# EAGLE design SOIC16-TSSOP16 (EAGLE 7.2.0)
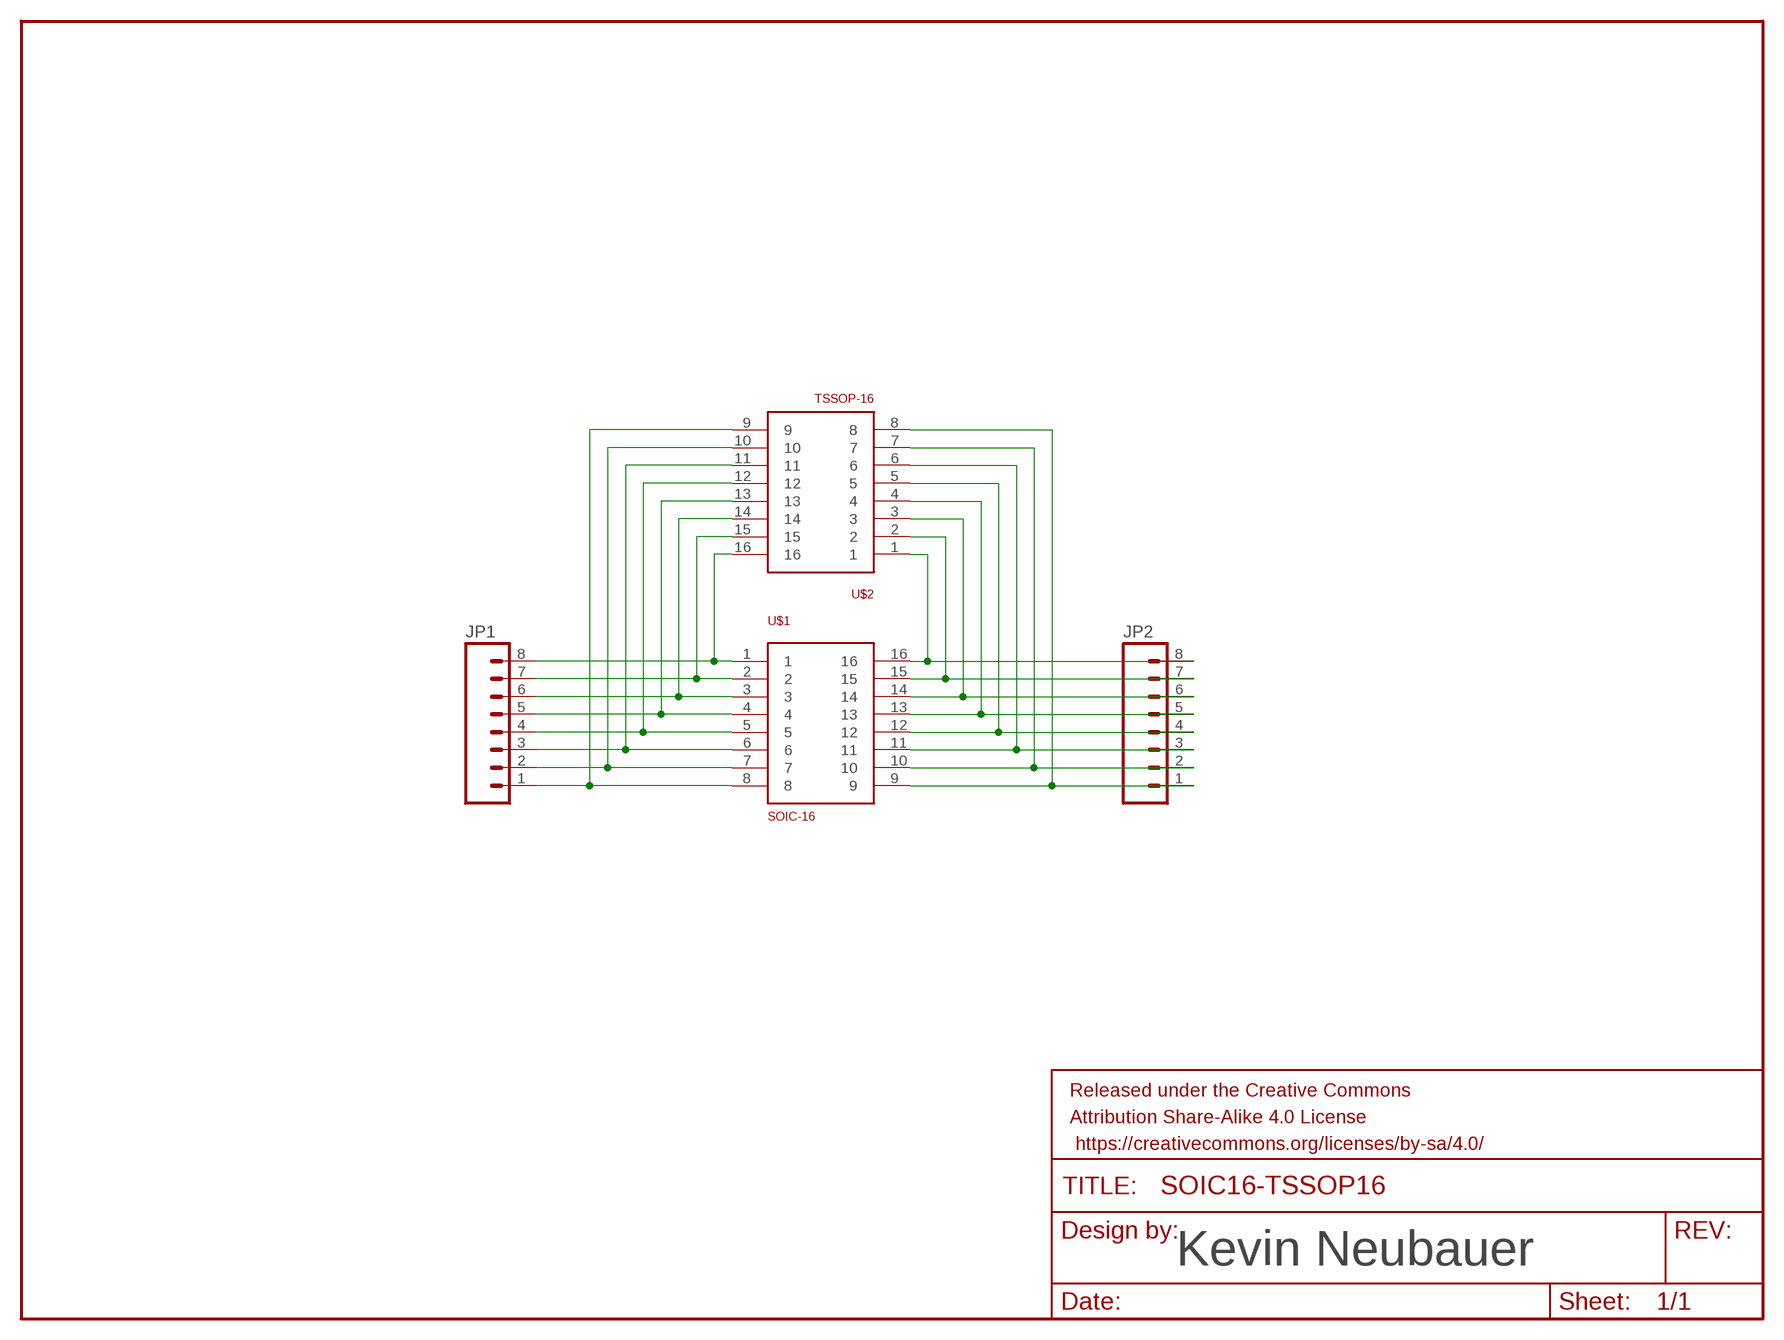
[diagram p0: schematic, sheet 1]

## Parts
FRAME1  FRAME-LETTER  [CREATIVE_COMMONS]
JP1  M08NO_SILK  [1X08_NO_SILK]
JP2  M08NO_SILK  [1X08_NO_SILK]
U$1  SOIC-16  [SO16]
U$2  TSSOP-16  [TSSOP16]

## Nets
N$1: JP1.8 U$1.1 U$2.16
N$2: JP1.7 U$1.2 U$2.15
N$3: JP1.6 U$1.3 U$2.14
N$4: JP1.5 U$1.4 U$2.13
N$5: JP1.4 U$1.5 U$2.12
N$6: JP1.3 U$1.6 U$2.11
N$7: JP1.2 U$1.7 U$2.10
N$8: JP1.1 U$1.8 U$2.9
N$11: JP2.8 U$1.16 U$2.1
N$12: JP2.7 U$1.15 U$2.2
N$13: JP2.6 U$1.14 U$2.3
N$14: JP2.5 U$1.13 U$2.4
N$15: JP2.4 U$1.12 U$2.5
N$16: JP2.3 U$1.11 U$2.6
N$17: JP2.2 U$1.10 U$2.7
N$18: JP2.1 U$1.9 U$2.8

## Notes on the sheet
- Kevin Neubauer

## Library data of the parts
FRAME1 = SparkFun-Aesthetics:FRAME-LETTER: Schematic Frame Standard 8.5x11 US Letter frame
JP1 JP2 = SparkFun-Connectors:M08: Header 8 Standard 8-pin 0.1" header. Use with straight break away headers (SKU : PRT-00116), right angle break away headers (PRT-00553), swiss pins (PRT-00743), machine pins (PRT-00117), and female headers (PRT-00115).
U$1 = Kevin-GenericICFootprints:SOIC-16
U$2 = Kevin-GenericICFootprints:TSSOP-16

## Board
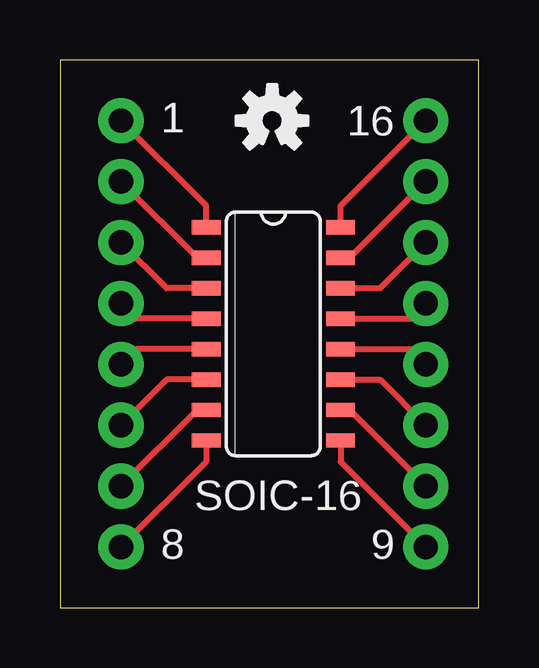
[diagram p1: board, top side]
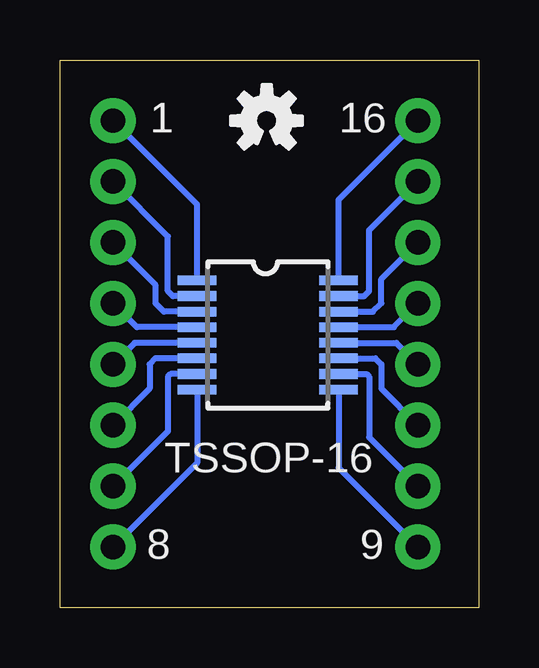
[diagram p2: board, bottom side, seen from below]

Size 17.45 x 22.85 mm. Coordinates in mm from the lower left corner, seen from the top.
Outline: 0,0 17.45,0 17.45,22.85 0,22.85 0,0
Copper layers (1*16): Top 0.035mm / dielectric 1.5mm / Bottom 0.035mm
Design rules "dirt_cheap_dirty_boards.v1": minimum track width 5mil, minimum drill 12mil, track to track 5mil, track to pad 5mil, pad to pad 5mil, via to via 5mil, smd to smd 0mil, copper to edge 10mil, drill to drill 10mil, minimum pad ring 10mil, minimum via ring 6mil, stop-mask expansion 2mil, vias tented up to drill 25mil, thermal gap 10mil

### Footprints (pad centres in the part's own frame; a part is rotated, then mirrored left to right if it is on the bottom)
1X08_NO_SILK = drill 1.016 pad 1.88: 1 0,0; 2 2.54,0; 3 5.08,0; 4 7.62,0; 5 10.16,0; 6 12.7,0; 7 15.24,0; 8 17.78,0
SO16 = smd 0.6 x 1.2: 1 -4.445,-2.8; 2 -3.175,-2.8; 3 -1.905,-2.8; 4 -0.635,-2.8; 5 0.635,-2.8; 6 1.905,-2.8; 7 3.175,-2.8; 8 4.445,-2.8; 9 4.445,2.8; 10 3.175,2.8; 11 1.905,2.8; 12 0.635,2.8; 13 -0.635,2.8; 14 -1.905,2.8; 15 -3.175,2.8; 16 -4.445,2.8
TSSOP16 = smd 0.4 x 1.6: 1 -2.225,-2.85; 2 -1.575,-2.85; 3 -0.925,-2.85; 4 -0.275,-2.85; 5 0.375,-2.85; 6 1.025,-2.85; 7 1.675,-2.85; 8 2.325,-2.85; 9 2.325,3.05; 10 1.675,3.05; 11 1.025,3.05; 12 0.375,3.05; 13 -0.275,3.05; 14 -0.925,3.05; 15 -1.575,3.05; 16 -2.225,3.05

### Placement (x,y rotation side)
FRAME1  -10.92,-7.82 0 top  (outside the outline)
JP1  2.54,2.54 90 top
JP2  15.24,2.54 90 top
U$1  8.89,11.43 270 top
U$2  8.89,11.43 270 bottom
U$3  [OSHW-LOGO-S]  8.84,20.32 0 top
U$4  [OSHW-LOGO-S]  8.84,20.32 0 bottom

### Tracks (layer width: path | path; a pad name or v marks a point on that pad's centre or on a via)
N$1
  Top 0.254: U$1.1 6.09,16.77 JP1.8
  Bottom 0.254: U$2.16 5.84,17.02 JP1.8
N$2
  Top 0.254: U$1.2 5.71,14.6 JP1.7
  Bottom 0.254: U$2.15 4.78,13.01 4.57,13.21 4.57,15.75 JP1.7
N$3
  Top 0.254: U$1.3 4.45,13.33 JP1.6
  Bottom 0.254: U$2.14 4.41,12.35 4.06,12.7 4.06,13.72 JP1.6
N$4
  Top 0.254: U$1.4 3.18,12.06 JP1.5
  Bottom 0.254: U$2.13 3.53,11.71 JP1.5
N$5
  Top 0.254: U$1.5 3.18,10.79 JP1.4
  Bottom 0.254: U$2.12 3.44,11.06 JP1.4
N$6
  Top 0.254: U$1.6 4.45,9.53 JP1.3
  Bottom 0.254: U$2.11 4.31,10.4 4.06,10.16 4.06,9.14 JP1.3
N$7
  Top 0.254: U$1.7 5.71,8.26 JP1.2
  Bottom 0.254: U$2.10 4.68,9.76 4.57,9.65 4.57,7.11 JP1.2
N$8
  Top 0.254: U$1.8 6.09,6.09 JP1.1
  Bottom 0.254: U$2.9 5.84,5.84 JP1.1
N$11
  Top 0.254: U$1.16 11.69,16.77 JP2.8
  Bottom 0.254: U$2.1 11.74,16.82 JP2.8
N$12
  Top 0.254: U$1.15 12.07,14.6 JP2.7
  Bottom 0.254: U$2.2 12.75,13.01 12.95,13.21 12.95,15.49 JP2.7
N$13
  Top 0.254: U$1.14 13.34,13.33 JP2.6
  Bottom 0.254: U$2.3 13.12,12.35 13.46,12.7 13.46,13.46 JP2.6
N$14
  Top 0.254: U$1.13 14.61,12.06 JP2.5
  Bottom 0.254: U$2.4 14.25,11.71 JP2.5
N$15
  Top 0.254: U$1.12 14.61,10.79 JP2.4
  Bottom 0.254: U$2.5 14.35,11.06 JP2.4
N$16
  Top 0.254: U$1.11 13.34,9.53 JP2.3
  Bottom 0.254: U$2.6 13.47,10.4 13.72,10.16 13.72,9.14 JP2.3
N$17
  Top 0.254: U$1.10 12.07,8.26 JP2.2
  Bottom 0.254: U$2.7 12.85,9.76 12.95,9.65 12.95,7.37 JP2.2
N$18
  Top 0.254: U$1.9 11.69,6.09 JP2.1
  Bottom 0.254: U$2.8 11.74,6.04 JP2.1

### Text on the board
tPlace: 1 | 16 | SOIC-16 | 8 | 9
bPlace: 16 | 1 | TSSOP-16 | 9 | 8
tDocu: Kevin Neubauer